# Altium project EndDevice.PrjPcb
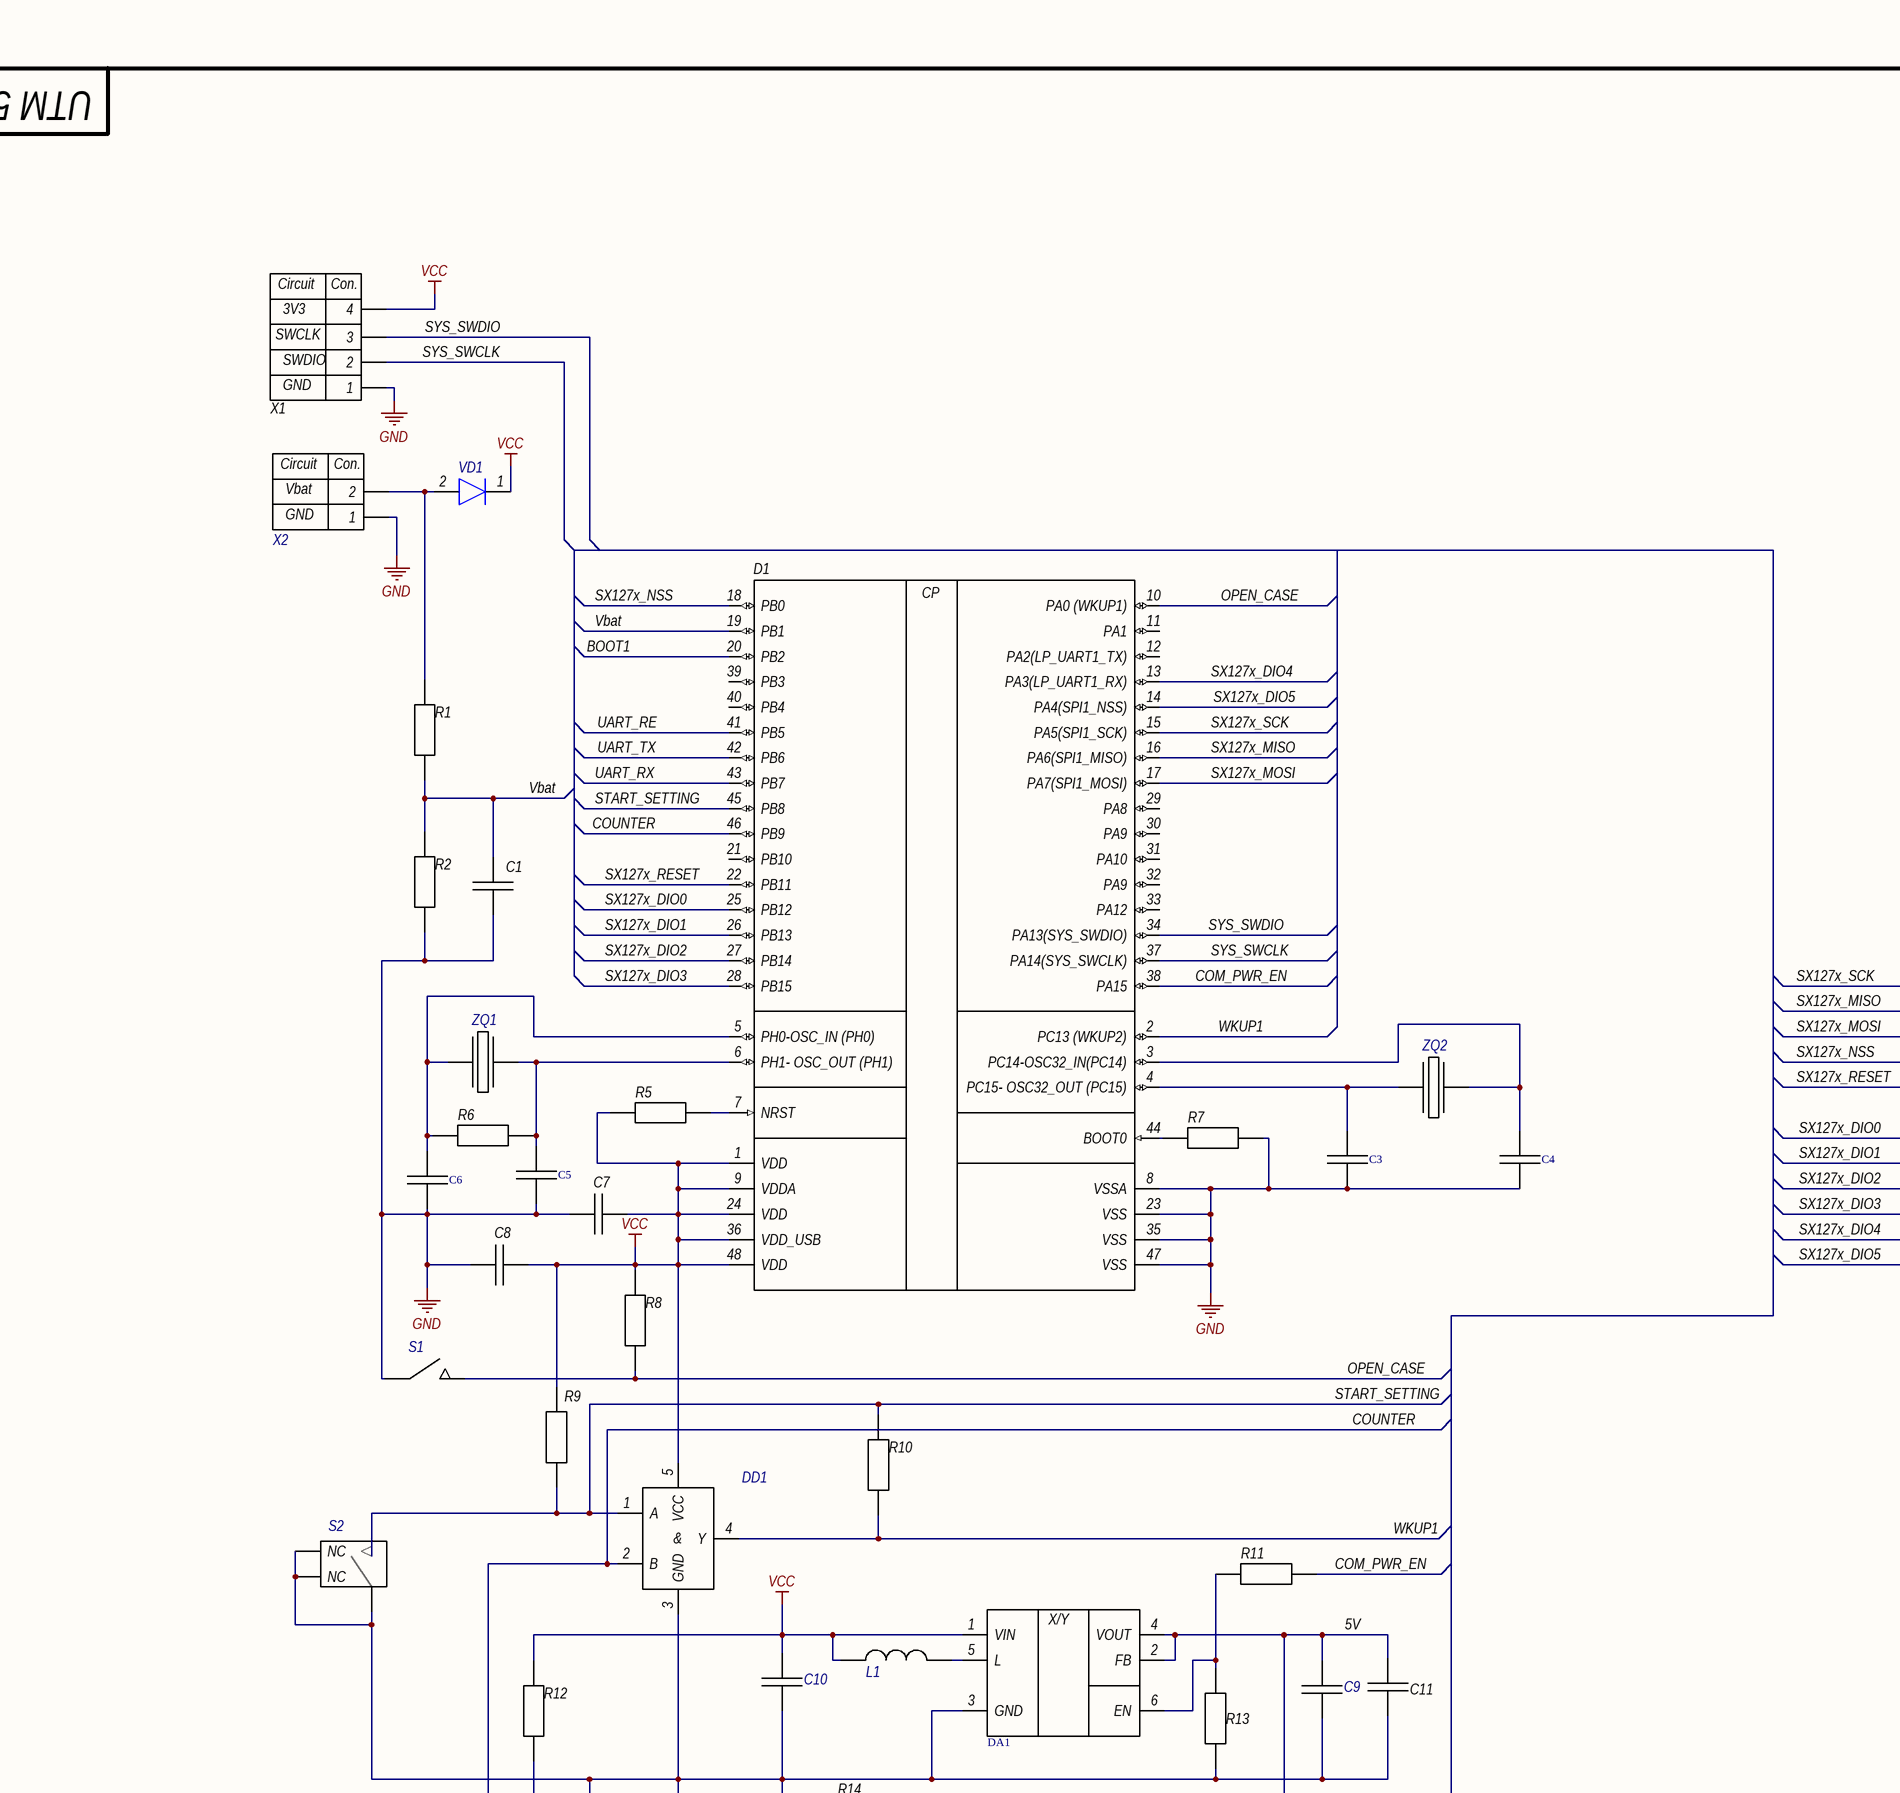
[diagram p0: Sheet1.SchDoc, top left]
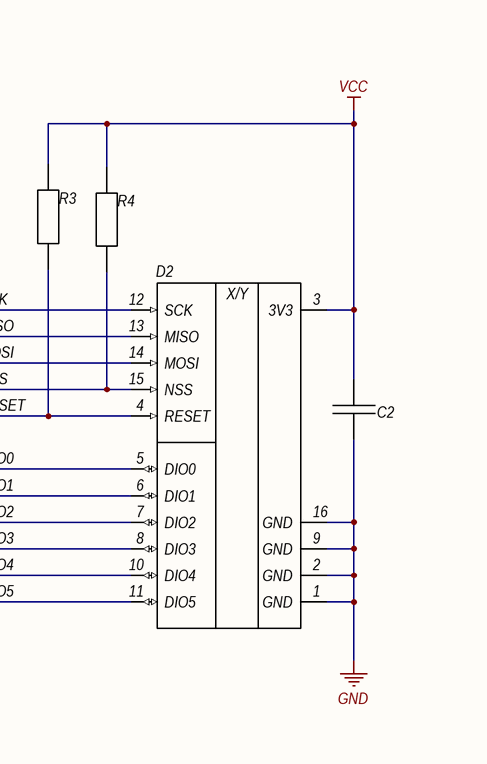
[diagram p1: Sheet1.SchDoc, top right]
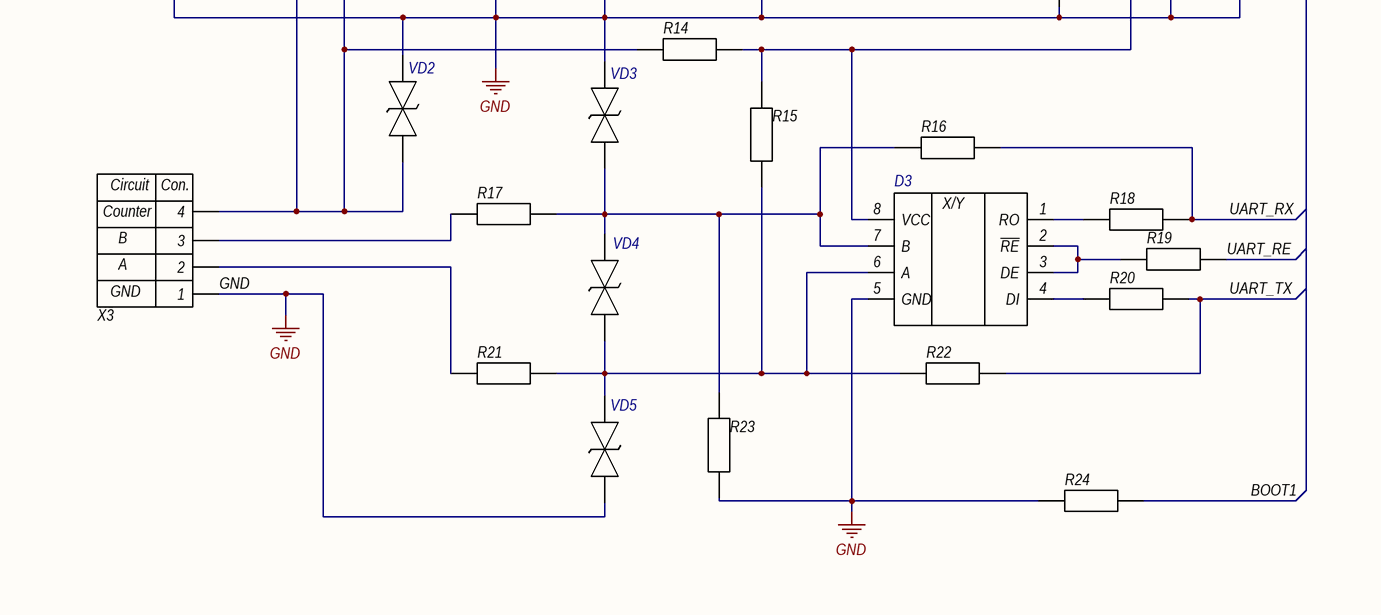
[diagram p2: Sheet1.SchDoc, bottom left]
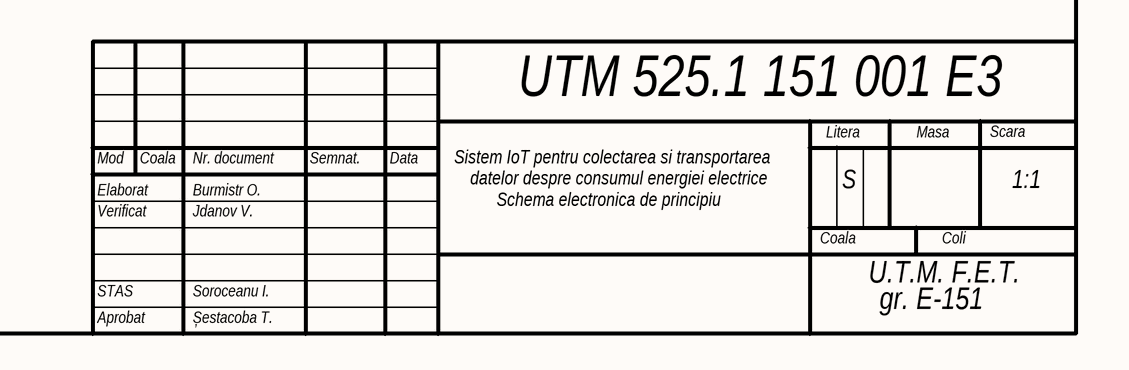
[diagram p3: Sheet1.SchDoc, bottom right]
1 sheet, 53 parts. Net scope: global (net labels, ports and power ports of the same name join across sheets).
Board file: PCB1.PcbDoc

## Sheet Sheet1.SchDoc
size 840 x 594 mm

### Parts
C1  100nF  [CAPC1608X87N]  (value not drawn)
C2  100nF  [CAPC1608X87N]  (value not drawn)
C3  9pF  [CAPC1608X87N]  (value not drawn)
C4  9pF  [CAPC1608X87N]  (value not drawn)
C5  18pF  [CAPC1608X87N]  (value not drawn)
C6  18pF  [CAPC1608X87N]  (value not drawn)
C7  100nF  [CAPC1608X87N]  (value not drawn)
C8  100nF  [CAPC1608X87N]  (value not drawn)
C9  10uF  [CAPC1608X90N]  (value not drawn)
C10  10uF  [CAPC1608X90N]  (value not drawn)
C11  100nF  [CAPC1608X87N]  (value not drawn)
D1  STM32L072CBT6  [LQFP-48N]  (value not drawn)
D2  SX1278  [RA-02 Lora]  (value not drawn)
D3  ST485CDR  [SOIC127P600X175-8N]  (value not drawn)
DA1  TPS61222DCKR  [SOT65P210X110-6N]  (value not drawn)
DD1  SN74AUP1G08DBVR  [SOT95P280X145-5N]  (value not drawn)
L1  4.7uH  [1239ASH100MP2]  (value not drawn)
R1  10M  [R0603]  (value not drawn)
R2  10M  [R0603]  (value not drawn)
R3  10M  [R0603]  (value not drawn)
R4  10M  [R0603]  (value not drawn)
R5  10M  [R0603]  (value not drawn)
R6  10M  [R0603]  (value not drawn)
R7  10M  [R0603]  (value not drawn)
R8  10M  [R0603]  (value not drawn)
R9  10M  [R0603]  (value not drawn)
R10  0  [R0603]  (value not drawn)
R11  10  [R0603]  (value not drawn)
R12  10M  [R0603]  (value not drawn)
R13  10M  [R0603]  (value not drawn)
R14  0  [R0603]  (value not drawn)
R15  47k  [R0603]  (value not drawn)
R16  0  [R0603]  (value not drawn)
R17  10  [R0603]  (value not drawn)
R18  10  [R0603]  (value not drawn)
R19  10  [R0603]  (value not drawn)
R20  10  [R0603]  (value not drawn)
R21  10  [R0603]  (value not drawn)
R22  0  [R0603]  (value not drawn)
R23  47k  [R0603]  (value not drawn)
R24  10M  [R0603]  (value not drawn)
S1  PTS636_SL43_LFS  [PTS636SL43LFS]  (value not drawn)
S2  FSMRA6JH  [FSMRA6JH]  (value not drawn)
VD1  NSVR0320MW2T1G  [SOD2512X110N]  (value not drawn)
VD2  ESD9B5.0ST5G  [SODFL1006X40N]  (value not drawn)
VD3  ESD9B5.0ST5G  [SODFL1006X40N]  (value not drawn)
VD4  ESD9B5.0ST5G  [SODFL1006X40N]  (value not drawn)
VD5  ESD9B5.0ST5G  [SODFL1006X40N]  (value not drawn)
X1  (no value)  [HDRV1W64P254_1X4_254X241X838P]
X2  Connector_2  [Pad_Connector_2]  (value not drawn)
X3  *  [Conector]  (value not drawn)
ZQ1  8MHz  [ABM38000MHzD2YT]  (value not drawn)
ZQ2  32.768k  [CM7VT1A32768kHz125pF10PPMTBQC]  (value not drawn)

### Nets
GND: C1.2 C2.1 C3.1 C4.1 C5.1 C6.1 C7.2 C8.2 C9.1 C10.1 C11.1 D1.8(VSSA) D1.23(VSS) D1.35(VSS) D1.47(VSS) D2.1(GND) D2.2(GND) D2.9(GND) D2.16(GND) D3.5(GND) DA1.3(GND) DD1.3(GND) R2.1 R7.2 R13.2 R23.1 R24.2 S1.1 S2.2(NO) S2.MH1(NC) S2.MH2(NC) VD2.2(A) VD3.2(A) VD5.1(K) X1.1 X2.1 X3.1
VCC: C2.2 C7.1 C8.1 C10.2 D1.1(VDD) D1.9(VDDA) D1.24(VDD) D1.36(VDD_USB) D1.48(VDD) D2.3(3V3) DA1.1(VIN) DD1.5(VCC) L1.1 R3.2 R4.2 R5.1 R8.2 R9.2 R12.2 VD1.1(K) X1.4
5V: C9.2 C11.2 D3.8(VCC) DA1.2(FB) DA1.4(VOUT) R14.1 R15.2
BOOT1: D1.20(PB2) R24.1
COM_PWR_EN: D1.38(PA15) R11.2
COUNTER: D1.46(PB9) DD1.2(B) R12.1 R14.2 VD2.1(K) X3.4
OPEN_CASE: D1.10(PA0_(WKUP1)) R8.1 S1.2
START_SETTING: D1.45(PB8) DD1.1(A) R9.1 R10.2 S2.1(COM)
SX127x_DIO0: D1.25(PB12) D2.5(DIO0)
SX127x_DIO1: D1.26(PB13) D2.6(DIO1)
SX127x_DIO2: D1.27(PB14) D2.7(DIO2)
SX127x_DIO3: D1.28(PB15) D2.8(DIO3)
SX127x_DIO4: D1.13(PA3(LP_UART1_RX)) D2.10(DIO4)
SX127x_DIO5: D1.14(PA4(SPI1_NSS)) D2.11(DIO5)
SX127x_MISO: D1.16(PA6(SPI1_MISO)) D2.13(MISO)
SX127x_MOSI: D1.17(PA7(SPI1_MOSI)) D2.14(MOSI)
SX127x_NSS: D1.18(PB0) D2.15(NSS) R4.1
SX127x_RESET: D1.22(PB11) D2.4(RESET) R3.1
SX127x_SCK: D1.15(PA5(SPI1_SCK)) D2.12(SCK)
SYS_SWCLK: D1.37(PA14(SYS_SWCLK)) X1.2
SYS_SWDIO: D1.34(PA13(SYS_SWDIO)) X1.3
UART_RE: D1.41(PB5) R19.2
UART_RX: D1.43(PB7) R16.1 R18.2
UART_TX: D1.42(PB6) R20.2 R22.1
Vbat: C1.1 D1.19(PB1) R1.1 R2.2
WKUP1: D1.2(PC13_(WKUP2)) DD1.4(Y) R10.1
NetC3_2: C3.2 D1.4(PC15-_OSC32_OUT_(PC15)) ZQ2.1
NetC4_2: C4.2 D1.3(PC14-OSC32_IN(PC14)) ZQ2.2
NetC5_2: C5.2 D1.6(PH1-_OSC_OUT_(PH1)) R6.1 ZQ1.2
NetC6_2: C6.2 D1.5(PH0-OSC_IN_(PH0)) R6.2 ZQ1.1
NetD1_7: D1.7(NRST) R5.2
NetD1_44: D1.44(BOOT0) R7.1
NetD3_1: D3.1(RO) R18.1
NetD3_2: D3.2(~{RE}) D3.3(DE) R19.1
NetD3_4: D3.4(DI) R20.1
NetD3_6: D3.6(A) R15.1 R21.2 R22.2 VD4.1(K) VD5.2(A)
NetD3_7: D3.7(B) R16.2 R17.2 R23.2 VD3.1(K) VD4.2(A)
NetDA1_5: DA1.5(L) L1.2
NetDA1_6: DA1.6(EN) R11.1 R13.1
NetR1_2: R1.2 VD1.2(A) X2.2
NetR17_1: R17.1 X3.3
NetR21_1: R21.1 X3.2

Not connected (* = marked no-connect by the designer): D1 11(PA1) 12(PA2(LP_UART1_TX)) 21(PB10) 29(PA8) 30(PA9) 31(PA10) 32(PA9) 33(PA12) 39(PB3) 40(PB4)

### Notes on the sheet
- UTM 525.1 151 001 E3
- (near X1) SWCLK
- 3V3
- (near X1) SWDIO
- GND
- (near X2) Vbat
- (near X3) Counter
- B
- A
- Mod
- Coala
- Nr. document
- Semnat.
- Data
- Sistem IoT pentru colectarea si transportarea
- datelor despre consumul energiei electrice
- Litera
- Masa
- Scara
- Elaborat
- Verificat
- Burmistr O.
- Jdanov V.
- Schema electronica de principiu
- S
- Coli
- 1:1
- STAS
- Soroceanu I.
- U.T.M. F.E.T.
- gr. E-151
- Aprobat
- Șestacoba T.
- (in symbol Connector) Circuit; Con.
- (in symbol Connector_2) Circuit; Con.
- (in symbol SN74AUP1G08DBVR) &
- (in symbol ST485CDR) X/Y
- (in symbol STM32L072CBT6) CP
- (in symbol SX1278) X/Y
- (in symbol TPS61222DCKR) X/Y

### Library data of the parts
C1 C2 C7 C8 C11 = Capacitor: Manufacture: Murata Electronics; Model: GCJ188R71C104MA01D; helpURL: https://eu.mouser.com/ProductDetail/Murata-Electronics/GCJ188R71C104MA01D?qs=sGAEpiMZZMs0AnBnWHyRQID2xuQsFd1GofHLF%2FZjZNHccNCeYysMBg%3D%3D; Case: 0603; Value: 100nF
C3 C4 = C0603C220F3HACTU: Capacitor; Manufacturer_Name: Murata Electronics; Manufacturer_Part_Number: GRM1885C1H9R0DA01D; Height: 0.87mm; Value: 9pF; helpURL: https://eu.mouser.com/ProductDetail/Murata-Electronics/GRM1885C1H9R0DA01D?qs=sGAEpiMZZMs0AnBnWHyRQOYRcarA5hN2DPY65XhHy0U%3D; Model: GRM1885C1H9R0DA01D; case: 0603
C5 C6 = C0603C220F3HACTU: Capacitor; Manufacturer_Name: Kemet; Height: 0.87mm; Mouser2 Part Number: 80-C0603C220F3HACTU; Manufacturer_Part_Number: C0603C220F3HACTU; Value: 18pF; helpURL: https://eu.mouser.com/ProductDetail/KEMET/C0603C180F3HACTU?qs=%2Fha2pyFadujq8NkOLYRmmNwJI7kFslpOt8gdR0UiXQGw%2Fa53lDXJFQ%3D%3D; Model: C0603C220F3HACTU; case: 0603
C9 C10 = GRM188R60J106ME84J: Capacitor; Manufacturer_Name: Murata Electronics; Height: 0.9mm; Mouser2 Part Number: 81-GRM188R60J106ME4J; Manufacturer_Part_Number: GRM188R60J106ME84J; helpURL: https://eu.mouser.com/ProductDetail/Murata-Electronics/GRM188R60J106ME84J?qs=sGAEpiMZZMs0AnBnWHyRQPhvn0V5nV7wdlV22aTabXS5iZ%252BKGPaWdQ%3D%3D; Value: 10uF; Manufacture: Murata Electronics; Model: GRM188R60J106ME84J
D1 = STM32L072CBT6: ARM Cortex M0+, 128 KB,  32 MHz; Manufacture: ST; Model: STM32L072CBT6; helpURL: https://www.st.com/en/microcontrollers-microprocessors/stm32l072cb.htmhttps://www.st.com/en/microcontrollers-microprocessors/stm32l072cb.html; Case: 48-LQFP
D2 = SX1278: Wireless Modules RoHS, Lora, 433 MHz; Manufacture: Ai-Thinker; Model: SX1278; helpURL: https://lcsc.com/product-detail/Wireless-Modules_SX1278LoRaWireless-Modules-Long10KM-433_C90039.html; Case: Customer
D3 = ST485CDR: Integrated Circuit; Manufacturer_Name: STMicroelectronics; Datasheet Link: https://componentsearchengine.com/Datasheets/1/ST485CDR.pdf; Height: 1.75mm; Mouser2 Part Number: 511-ST485CDR; Mouser2 Price/Stock: https://www.mouser.com/Search/Refine.aspx?Keyword=511-ST485CDR; Manufacturer_Part_Number: ST485CDR; Model: ST485CDR
DA1 = TPS61222DCKR: Integrated Circuit; Manufacturer_Name: Texas Instruments; Datasheet Link: https://www.ti.com/lit/gpn/TPS61222; Height: 1.1mm; Mouser2 Part Number: 595-TPS61222DCKR; Mouser2 Price/Stock: https://www.mouser.com/Search/Refine.aspx?Keyword=595-TPS61222DCKR; Manufacturer_Part_Number: TPS61222DCKR
DD1 = SN74AUP1G08DBVR: Integrated Circuit; Manufacturer_Name: Texas Instruments; Datasheet Link: http://www.ti.com/lit/gpn/sn74aup1g08; Height: 1.45mm; Manufacturer_Part_Number: SN74AUP1G08DBVR; Model: SN74AUP1G08DBVR
L1 = Cooil: Manufacture: Coilcraft; Model: EPL3015-472MLB; Value: 4.7uH; helpURL: https://eu.mouser.com/ProductDetail/Coilcraft/EPL3015-472MLB?qs=sGAEpiMZZMsg%252By3WlYCkU2kWFds1hA9DlWz4EahPFXQ%3D
R1-R9 R12 R13 R24 = Resistor: Manufacture: Vishay / Dale; Model: CRCW060310M0JNEAC; helpURL: https://eu.mouser.com/ProductDetail/Vishay-Dale/CRCW060310M0JNEAC?qs=sGAEpiMZZMtlubZbdhIBIIZe04wfiaJWqGwkA21tjII%3D; Case: 0603; Value: 10M
R10 R14 R16 R22 = Resistor: Manufacture: Vishay / Dale; Model: CRCW06030000Z0EAC; helpURL: https://eu.mouser.com/ProductDetail/Vishay-Dale/CRCW06030000Z0EAC?qs=sGAEpiMZZMtlubZbdhIBIIZe04wfiaJWEAUMew4TANc%3D; Case: 0603; Value: 0
R11 R17-R21 = Resistor: Manufacture: Vishay / Dale; Model: CRCW060310R0FKEAC; helpURL: https://eu.mouser.com/ProductDetail/Vishay-Dale/CRCW060310R0FKEAC?qs=sGAEpiMZZMtlubZbdhIBIIZe04wfiaJWxDMmtLhgrug%3D; Case: 0603; Value: 10
R15 R23 = Resistor: Manufacture: Yageo; Model: RC0603FR-0747KL; helpURL: https://eu.mouser.com/ProductDetail/Yageo/RC0603FR-0747KL?qs=sGAEpiMZZMtlubZbdhIBIItYu4jZFrq8jA1HT%252B9Khos%3D; Case: 0603; Value: 47k
S1 = PTS636_SL43_LFS: Switch; Manufacturer_Name: C & K COMPONENTS; Manufacturer_Part_Number: PTS636 SL43 LFS; Datasheet Link: https://componentsearchengine.com/Datasheets/1/PTS636 SL43 LFS.pdf; Height: 4.5mm; Mouser2 Part Number: 611-PTS636SL43LFS; Mouser2 Price/Stock: https://www.mouser.com/Search/Refine.aspx?Keyword=611-PTS636SL43LFS; Model: PTS636 SL43 LFS
S2 = FSMRA6JH: Switch; Manufacturer_Name: TE Connectivity; Height: 7.01mm; Manufacturer_Part_Number: FSMRA6JH; helpURL: https://eu.mouser.com/ProductDetail/TE-Connectivity-PB/FSMRA6JH?qs=sGAEpiMZZMsgGjVA3toVBAK0o4DxfcqiZ%2FRlJR1iziM%3D; Model: FSMRA6JH
VD1 = NSVR0320MW2T1G: Diode; Manufacturer_Name: ON Semiconductor; Datasheet Link: https://componentsearchengine.com/Datasheets/2/NSVR0320MW2T1G.pdf; Height: 1.1mm; Manufacturer_Part_Number: NSVR0320MW2T1G; helpURL: https://eu.mouser.com/ProductDetail/ON-Semiconductor/NSVR0320MW2T1G?qs=%2Fha2pyFadujuJRQwCWoVTOD2UGuwG1BWdFMULlJZ9zj6n5RYExZtWw%3D%3D; Model: NSVR0320MW2T1G
VD2-VD5 = ESD9B5.0ST5G: Diode; Manufacturer_Name: ON Semiconductor; Height: 0.4mm; Mouser2 Part Number: 863-ESD9B5.0ST5G; Manufacturer_Part_Number: ESD9B5.0ST5G; helpURL: https://www.mouser.com/Search/Refine.aspx?Keyword=863-ESD9B5.0ST5G; Model: ESD9B5.0ST5G; Manufacture: ON Semiconductor
X1 X3 = Connector: Manufacture: TE Connectivity AMP Connectors; Model: 1776275-4; helpURL: https://www.digikey.com/product-detail/en/te-connectivity-amp-connectors/1776275-4/A98038-ND/1826901; Case: Terminal Bloak; Part number: 1776275-4
  X3: Value: *
ZQ1 = ABM3-8.000MHZ-B4Y-T: Crystal or Oscillator; Manufacturer_Name: ABRACON; Height: 1mm; Manufacturer_Part_Number: ABM3-8.000MHZ-B4Y-T; HelpURL: https://eu.mouser.com/ProductDetail/ABRACON/ABM3-8000MHZ-B4Y-T?qs=%252BlF%252B75lapNKxd1hbTYfShQ%3D%3D; Model: ABM3-8.000MHZ-B4Y-T
ZQ2 = CM7V-T1A-32.768k-9pF-20PPM-TA-QA_T3: Crystal or Oscillator; Manufacturer_Name: MICRO CRYSTAL; Manufacturer_Part_Number: CM7V-T1A-32.768k-9pF-20PPM-TA-QA T3; Height: 0.65mm; Mouser2 Part Number: 428-201568-MG03; Mouser2 Price/Stock: https://www.mouser.com/Search/Refine.aspx?Keyword=428-201568-MG03; Model: CM7V-T1A-32.768k-9pF-20PPM-TA-QA T3; helpURL: https://eu.mouser.com/ProductDetail/Micro-Crystal/CM7V-T1A-32768k-9pF-20PPM-TA-QA-T3?qs=%2Fha2pyFadui6AXBQ%2FVw18lA%252BLN0M9oEZsmyoRLoeGfq%2FVECMncxUBFCE3nNdh4yClz3k2BoauApbLLycflu%2FdA%3D%3D